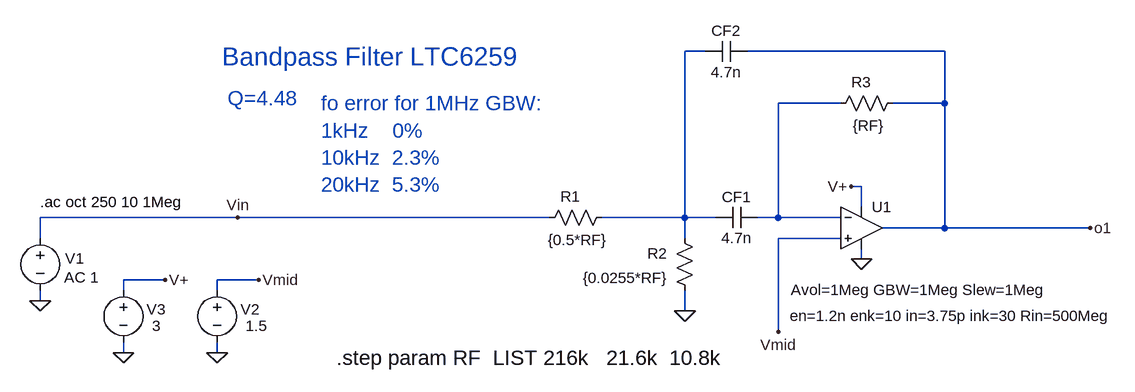
[diagram p0: schematic BPF fo Error vs GBW.asc]
BPF fo Error vs GBW.asc, the LTspice schematic file:
Version 4
SHEET 1 1928 1456
WIRE -4784 -3296 -4816 -3296
WIRE -4416 -3296 -4720 -3296
WIRE -4576 -3216 -4672 -3216
WIRE -4416 -3216 -4416 -3296
WIRE -4416 -3216 -4496 -3216
WIRE -4544 -3088 -4560 -3088
WIRE -4544 -3056 -4544 -3088
WIRE -5504 -3040 -5808 -3040
WIRE -5024 -3040 -5504 -3040
WIRE -4816 -3040 -4816 -3296
WIRE -4816 -3040 -4944 -3040
WIRE -4768 -3040 -4816 -3040
WIRE -4672 -3040 -4672 -3216
WIRE -4672 -3040 -4704 -3040
WIRE -4576 -3040 -4672 -3040
WIRE -4416 -3024 -4416 -3216
WIRE -4416 -3024 -4512 -3024
WIRE -4192 -3024 -4416 -3024
WIRE -5808 -3008 -5808 -3040
WIRE -4816 -3008 -4816 -3040
WIRE -4576 -3008 -4672 -3008
WIRE -4544 -2976 -4544 -2992
WIRE -5616 -2944 -5680 -2944
WIRE -5472 -2944 -5536 -2944
WIRE -5680 -2928 -5680 -2944
WIRE -5536 -2928 -5536 -2944
WIRE -5808 -2912 -5808 -2928
WIRE -4816 -2896 -4816 -2928
WIRE -4672 -2864 -4672 -3008
WIRE -5680 -2832 -5680 -2848
WIRE -5536 -2832 -5536 -2848
FLAG -5808 -2912 0
FLAG -5504 -3040 Vin
FLAG -4560 -3088 V+
FLAG -5616 -2944 V+
FLAG -5680 -2832 0
FLAG -4544 -2976 0
FLAG -4816 -2896 0
FLAG -5472 -2944 Vmid
FLAG -5536 -2832 0
FLAG -4672 -2864 Vmid
FLAG -4192 -3024 o1
SYMBOL voltage -5808 -3024 R0
WINDOW 0 38 47 Left 2
WINDOW 3 137 76 Invisible 2
WINDOW 123 37 76 Left 2
WINDOW 39 0 0 Left 2
SYMATTR InstName V1
SYMATTR Value SINE(0 1 20K)
SYMATTR Value2 AC 1
SYMBOL cap -4768 -3056 M90
WINDOW 0 0 32 VBottom 2
WINDOW 3 32 32 VTop 2
SYMATTR InstName CF1
SYMATTR Value 4.7n
SYMBOL Opamps\\UniversalOpamp2 -4544 -3024 R0
WINDOW 123 -109 95 Left 2
WINDOW 40 -110 135 Left 2
SYMATTR Value2 Avol=1Meg GBW=1Meg Slew=1Meg
SYMATTR SpiceLine2 en=1.2n enk=10 in=3.75p ink=30 Rin=500Meg
SYMATTR InstName U1
SYMBOL voltage -5680 -2944 R0
WINDOW 0 36 45 Left 2
WINDOW 3 44 71 Left 2
WINDOW 123 0 0 Left 2
WINDOW 39 0 0 Left 2
SYMATTR InstName V3
SYMATTR Value 3
SYMBOL cap -4784 -3312 M90
WINDOW 0 0 32 VBottom 2
WINDOW 3 32 32 VTop 2
SYMATTR InstName CF2
SYMATTR Value 4.7n
SYMBOL res -4928 -3056 R90
WINDOW 0 -1 64 VBottom 2
WINDOW 3 35 53 VTop 2
SYMATTR InstName R1
SYMATTR Value {0.5*RF}
SYMBOL res -4800 -2912 R180
WINDOW 0 43 73 Left 2
WINDOW 3 41 35 Left 2
SYMATTR InstName R2
SYMATTR Value {0.0255*RF}
SYMBOL res -4480 -3232 R90
WINDOW 0 -1 64 VBottom 2
WINDOW 3 35 53 VTop 2
SYMATTR InstName R3
SYMATTR Value {RF}
SYMBOL voltage -5536 -2944 R0
WINDOW 0 36 45 Left 2
WINDOW 3 44 71 Left 2
WINDOW 123 0 0 Left 2
WINDOW 39 0 0 Left 2
SYMATTR InstName V2
SYMATTR Value 1.5
TEXT -5808 -3064 Left 2 !.ac oct 250 10 1Meg
TEXT -5528 -3288 Left 4 ;Bandpass Filter LTC6259
TEXT -5352 -2824 Left 3 !.step param RF  LIST 216k   21.6k  10.8k
TEXT -5376 -3216 Left 3 ;fo error for 1MHz GBW:\n1kHz    0%\n10kHz  2.3%\n20kHz  5.3%
TEXT -5520 -3224 Left 3 ;Q=4.48

The netlist it stands for:
* BPF fo Error vs GBW.asc
V1 Vin 0 SINE(0 1 20K) AC 1
CF1 N001 N002 4.7n
XU1 Vmid N002 V+ 0 o1 level.2 Avol=1Meg GBW=1Meg Slew=1Meg ilimit=25m rail=0 Vos=0 phimargin=45 en=1.2n enk=10 in=3.75p ink=30 Rin=500Meg  ; pins IN+ IN- V+ V- OUT
V3 V+ 0 3
CF2 N001 o1 4.7n
R1 N001 Vin {0.5*RF}
R2 0 N001 {0.0255*RF}
R3 o1 N002 {RF}
V2 Vmid 0 1.5
.ac oct 250 10 1Meg
* Bandpass Filter LTC6259
.step param RF  LIST 216k   21.6k  10.8k
* fo error for 1MHz GBW:
* 1kHz    0%
* 10kHz  2.3%
* 20kHz  5.3%
* Q=4.48
.lib UniversalOpamps2.sub
.backanno
.end